# EAGLE design pxdr-001 (EAGLE 9.6.2)
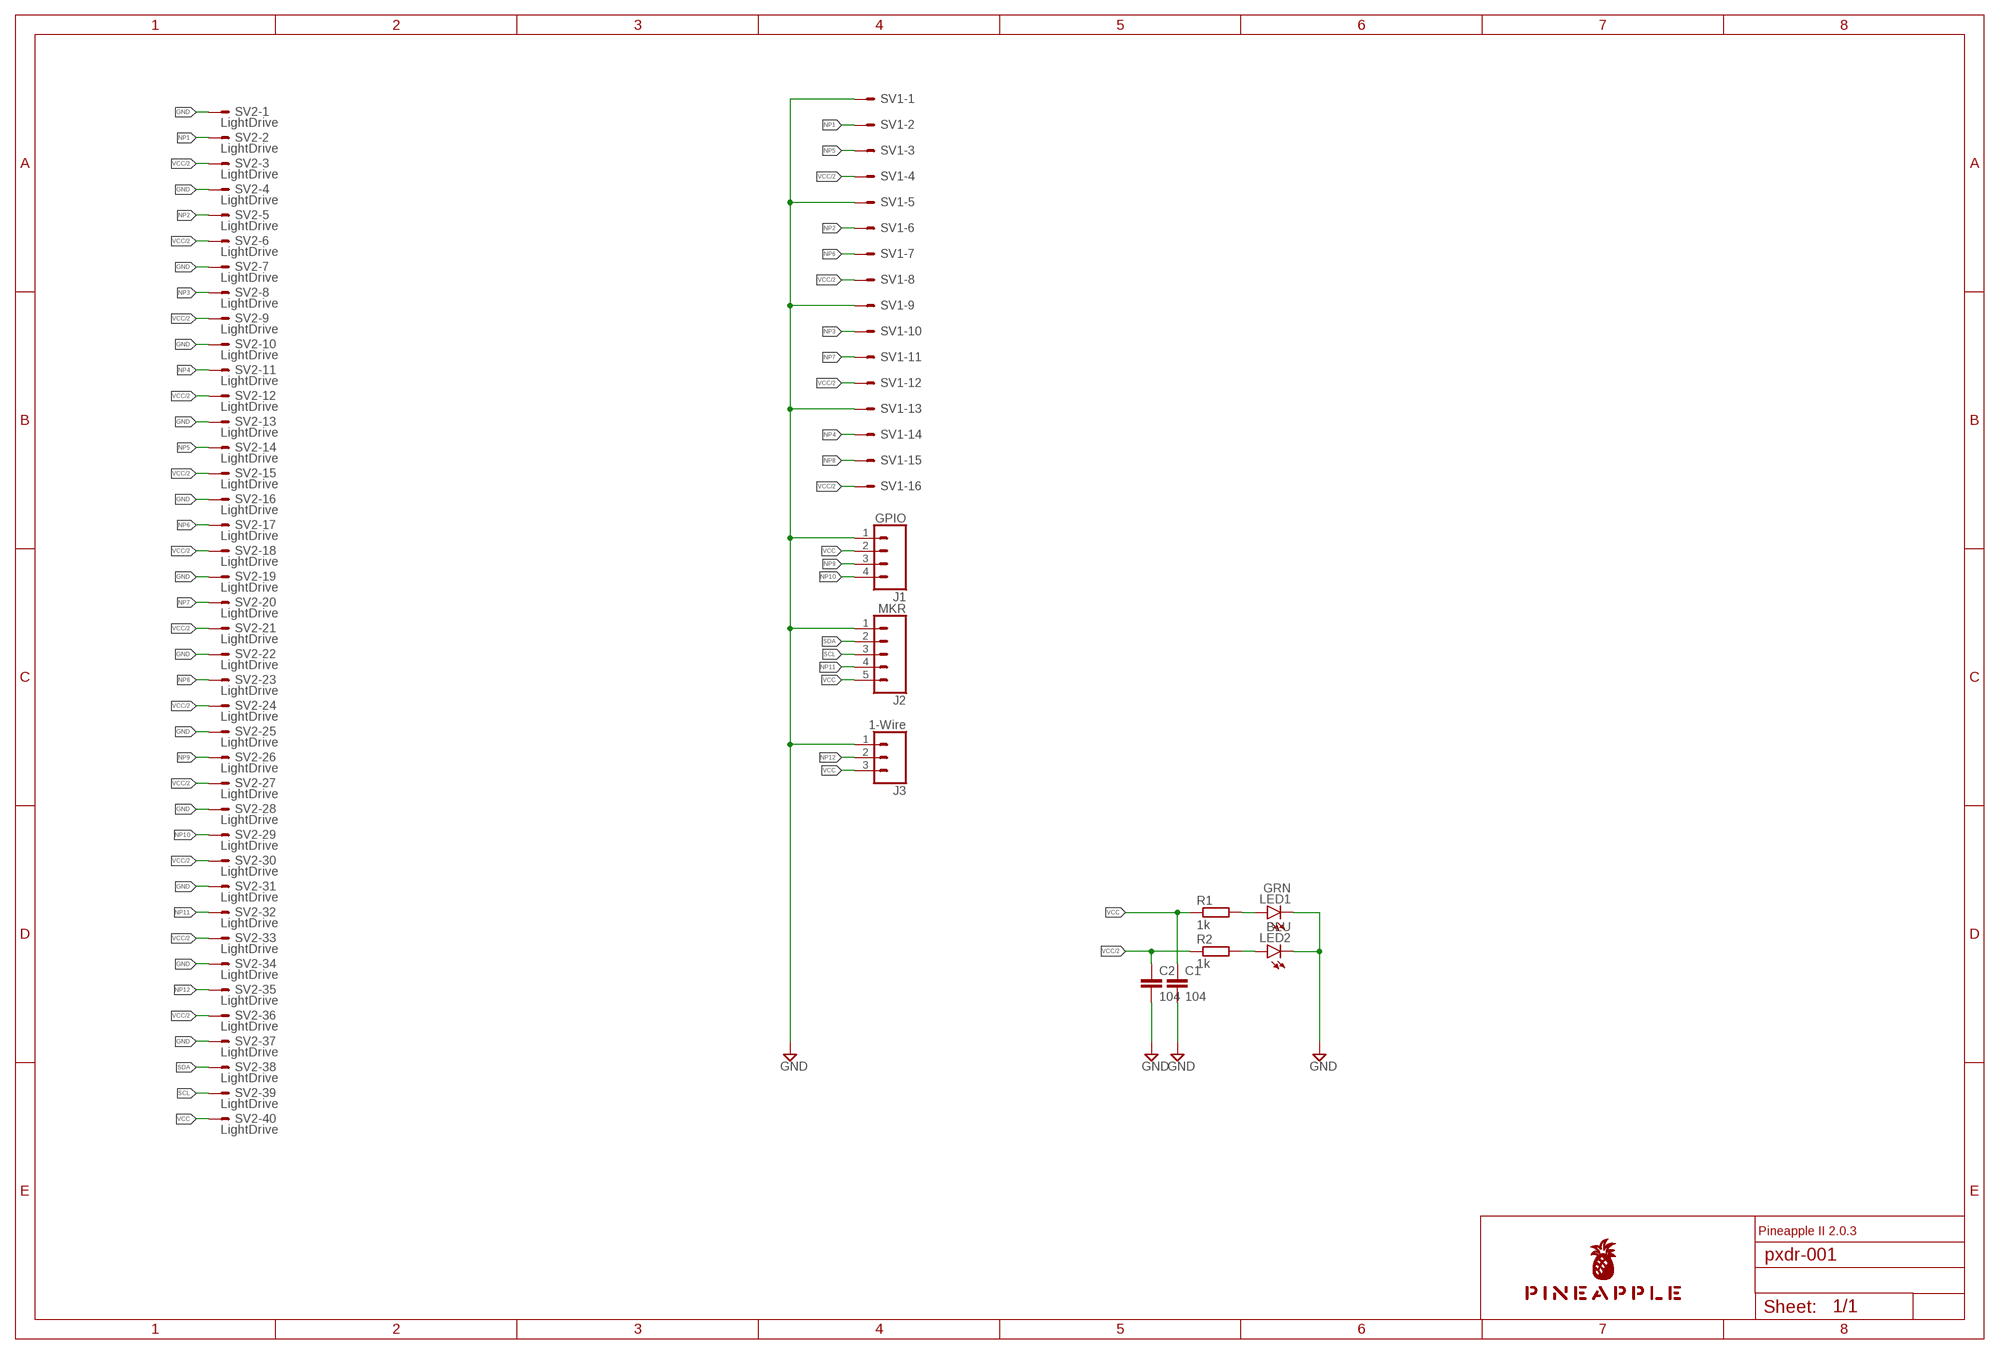
[diagram p0: schematic, sheet 1]

## Parts
C1  104  C-EU025-025X050  [C025-025X050]
C2  104  C-EU025-025X050  [C025-025X050]
J1  GPIO  CONN_04JST-PTH  [JST-4-PTH]
J2  MKR  CONN_05JST  [JST-5-PTH]
J3  1-Wire  CONN_03JST-PTH  [JST-3-PTH]
LED1  GRN  LEDB152  [Q62902-B152]
LED2  BLU  LEDB152  [Q62902-B152]
R1  1k  R-EU_0204/5  [0204/5]
R2  1k  R-EU_0204/5  [0204/5]
SV1  ML16LE  [ML16L]
SV2  LightDrive  ML40LE  [ML40L]
U$1  PINEAPPLE450_SILK  [PINEAPPLE450_SILK]

## Nets
GND [gnd]: C1.2 C2.2 J1.1 J2.1 J3.1 LED1.K(C) LED2.K(C) SV1.1 SV1.5 SV1.9 SV1.13 SV2.1 SV2.4 SV2.7 SV2.10 SV2.13 SV2.16 SV2.19 SV2.22 SV2.25 SV2.28 SV2.31 SV2.34 SV2.37
NP1: SV1.2 SV2.2
NP2: SV1.6 SV2.5
NP3: SV1.10 SV2.8
NP4: SV1.14 SV2.11
NP5: SV1.3 SV2.14
NP6: SV1.7 SV2.17
NP7: SV1.11 SV2.20
NP8: SV1.15 SV2.23
NP9: J1.3 SV2.26
NP10: J1.4 SV2.29
NP11: J2.4 SV2.32
NP12: J3.2 SV2.35
SCL: J2.3 SV2.39
SDA: J2.2 SV2.38
VCC [power]: C1.1 J1.2 J2.5 J3.3 R1.1 SV2.40
VCC2LED: LED2.A R2.2
VCC/2 [power]: C2.1 R2.1 SV1.4 SV1.8 SV1.12 SV1.16 SV2.3 SV2.6 SV2.9 SV2.12 SV2.15 SV2.18 SV2.21 SV2.24 SV2.27 SV2.30 SV2.33 SV2.36
VCCLED: LED1.A R1.2

## Notes on the sheet
- Pineapple II 2.0.3

## Library data of the parts
C1 C2 = rcl:C-EU: CAPACITOR, European symbol; SPICEPREFIX: C
J1 = SparkFun-Connectors:CONN_04: Multi connection point. Often used as Generic Header-pin footprint for 0.1 inch spaced/style header connections On any of the 0.1 inch spaced packages, you can populate with these: Break Away Headers - Straight <https://www.sparkfun.com/products/116> (PRT-00116) Break Away Male Headers - Right Angle <https://www.sparkfun.com/products/553> (PRT-00553) Female Headers <https://www.sparkfun.com/products/115> (PRT-00115) Break Away Headers - Machine Pin <https://www.sparkfun.com/products/117> (PRT-00117) Break Away Female Headers - Swiss Machine Pin <https://www.sparkfun.com/products/743> (PRT-00743) For SCREWTERMINALS and SPRING TERMINALS visit here: Screw Terimnals on SparkFun.com <https://www.sparkfun.com/search/results?term=Screw+Terminals> (5mm/3.5mm/2.54mm spacing) This device is also useful as a general connection point to wire up your design to another part of your project. Our various solder wires solder well into these plated through hole pads. Hook-Up Wire - Assortment (Stranded, 22 AWG) <https://www.sparkfun.com/products/11375> (PRT-11375) Hook-Up Wire - Assortment (Solid Core, 22 AWG) <https://www.sparkfun.com/products/11367> (PRT-11367) View the entire wire category on our website here <https://www.sparkfun.com/categories/141> Special notes: Molex polarized connector foot print use with SKU : PRT-08231 with associated crimp pins and housings. 1MM SMD Version SKU: PRT-10208; PROD_ID: WIRE-13531; SF_ID: PRT-09916
J2 = SparkFun-Connectors:CONN_05: Multi connection point. Often used as Generic Header-pin footprint for 0.1 inch spaced/style header connections On any of the 0.1 inch spaced packages, you can populate with these: Break Away Headers - Straight <https://www.sparkfun.com/products/116> (PRT-00116) Break Away Male Headers - Right Angle <https://www.sparkfun.com/products/553> (PRT-00553) Female Headers <https://www.sparkfun.com/products/115> (PRT-00115) Break Away Headers - Machine Pin <https://www.sparkfun.com/products/117> (PRT-00117) Break Away Female Headers - Swiss Machine Pin <https://www.sparkfun.com/products/743> (PRT-00743) For SCREWTERMINALS and SPRING TERMINALS visit here: Screw Terimnals on SparkFun.com <https://www.sparkfun.com/search/results?term=Screw+Terminals> (5mm/3.5mm/2.54mm spacing) This device is also useful as a general connection point to wire up your design to another part of your project. Our various solder wires solder well into these plated through hole pads. Hook-Up Wire - Assortment (Stranded, 22 AWG) <https://www.sparkfun.com/products/11375> (PRT-11375) Hook-Up Wire - Assortment (Solid Core, 22 AWG) <https://www.sparkfun.com/products/11367> (PRT-11367) View the entire wire category on our website here <https://www.sparkfun.com/categories/141> Special notes: Molex polarized connector foot print use with SKU : PRT-08231 with associated crimp pins and housings. 1MM SMD Version SKU: PRT-10208; SF_ID: PRT-09917
J3 = SparkFun-Connectors:CONN_03: Multi connection point. Often used as Generic Header-pin footprint for 0.1 inch spaced/style header connections On any of the 0.1 inch spaced packages, you can populate with these: Break Away Headers - Straight <https://www.sparkfun.com/products/116> (PRT-00116) Break Away Male Headers - Right Angle <https://www.sparkfun.com/products/553> (PRT-00553) Female Headers <https://www.sparkfun.com/products/115> (PRT-00115) Break Away Headers - Machine Pin <https://www.sparkfun.com/products/117> (PRT-00117) Break Away Female Headers - Swiss Machine Pin <https://www.sparkfun.com/products/743> (PRT-00743) Stackable Header - 3 Pin (Female, 0.1") <https://www.sparkfun.com/products/13875> (PRT-13875) For SCREWTERMINALS and SPRING TERMINALS visit here: Screw Terimnals on SparkFun.com <https://www.sparkfun.com/search/results?term=Screw+Terminals> (5mm/3.5mm/2.54mm spacing) This device is also useful as a general connection point to wire up your design to another part of your project. Our various solder wires solder well into these plated through hole pads. Hook-Up Wire - Assortment (Stranded, 22 AWG) <https://www.sparkfun.com/products/11375> (PRT-11375) Hook-Up Wire - Assortment (Solid Core, 22 AWG) <https://www.sparkfun.com/products/11367> (PRT-11367) View the entire wire category on our website here <https://www.sparkfun.com/categories/141> Special notes: Molex polarized connector foot print use with SKU : PRT-08232 with associated crimp pins and housings.; PROD_ID: WIRE-10037; SF_ID: PRT-09915
LED1 LED2 = led:LED: LED OSRAM: - CHIPLED LG R971, LG N971, LY N971, LG Q971, LY Q971, LO R971, LY R971 LH N974, LH R974 LS Q976, LO Q976, LY Q976 LO Q996 - Hyper CHIPLED LW Q18S LB Q993, LB Q99A, LB R99A - SideLED LS A670, LO A670, LY A670, LG A670, LP A670 LB A673, LV A673, LT A673, LW A673 LH A674 LY A675 LS A676, LA A676, LO A676, LY A676, LW A676 LS A679, LY A679, LG A679 - Hyper Micro SIDELED® LS Y876, LA Y876, LO Y876, LY Y876 LT Y87S - SmartLED LW L88C, LW L88S LB L89C, LB L89S, LG L890 LS L89K, LO L89K, LY L89K LS L896, LA L896, LO L896, LY L896 - TOPLED LS T670, LO T670, LY T670, LG T670, LP T670 LSG T670, LSP T670, LSY T670, LOP T670, LYG T670 LG T671, LOG T671, LSG T671 LB T673, LV T673, LT T673, LW T673 LH T674 LS T676, LA T676, LO T676, LY T676, LB T676, LH T676, LSB T676, LW T676 LB T67C, LV T67C, LT T67C, LS T67K, LO T67K, LY T67K, LW E67C LS E67B, LA E67B, LO E67B, LY E67B, LB E67C, LV E67C, LT E67C LW T67C LS T679, LY T679, LG T679 LS T770, LO T770, LY T770, LG T770, LP T770 LB T773, LV T773, LT T773, LW T773 LH T774 LS E675, LA E675, LY E675, LS T675 LS T776, LA T776, LO T776, LY T776, LB T776 LHGB T686 LT T68C, LB T68C - Hyper Mini TOPLED® LB M676 - Mini TOPLED Santana® LG M470 LS M47K, LO M47K, LY M47K Source: http://www.osram.convergy.de LUXEON: - LUMILED® LXK2-PW12-R00, LXK2-PW12-S00, LXK2-PW14-U00, LXK2-PW14-V00 LXK2-PM12-R00, LXK2-PM12-S00, LXK2-PM14-U00 LXK2-PE12-Q00, LXK2-PE12-R00, LXK2-PE12-S00, LXK2-PE14-T00, LXK2-PE14-U00 LXK2-PB12-K00, LXK2-PB12-L00, LXK2-PB12-M00, LXK2-PB14-N00, LXK2-PB14-P00, LXK2-PB14-Q00 LXK2-PR12-L00, LXK2-PR12-M00, LXK2-PR14-Q00, LXK2-PR14-R00 LXK2-PD12-Q00, LXK2-PD12-R00, LXK2-PD12-S00 LXK2-PH12-R00, LXK2-PH12-S00 LXK2-PL12-P00, LXK2-PL12-Q00, LXK2-PL12-R00 Source: www.luxeon.com KINGBRIGHT: KA-3528ASYC Source: www.kingbright.com
R1 R2 = rcl:R-EU_: RESISTOR, European symbol; SPICEPREFIX: R
SV1 = con-ml:ML16LE: HARTING; OC_FARNELL: unknown; OC_NEWARK: unknown
SV2 = con-ml:ML40LE: HARTING; OC_FARNELL: unknown; OC_NEWARK: unknown
U$1 = pineapple:PINEAPPLE450_SILK

## Net classes
0 default: width 0.152 mm, drill 0.152 mm, clearance 0.152 mm
1 gnd: width 0.305 mm, drill 0.152 mm, clearance 0.152 mm
2 power: width 0.508 mm, drill 0.152 mm, clearance 0.152 mm
3 analog: width 0.305 mm, drill 0.152 mm, clearance 0.152 mm
4 superpower: width 1.016 mm, drill 0.152 mm, clearance 0.152 mm

## Board
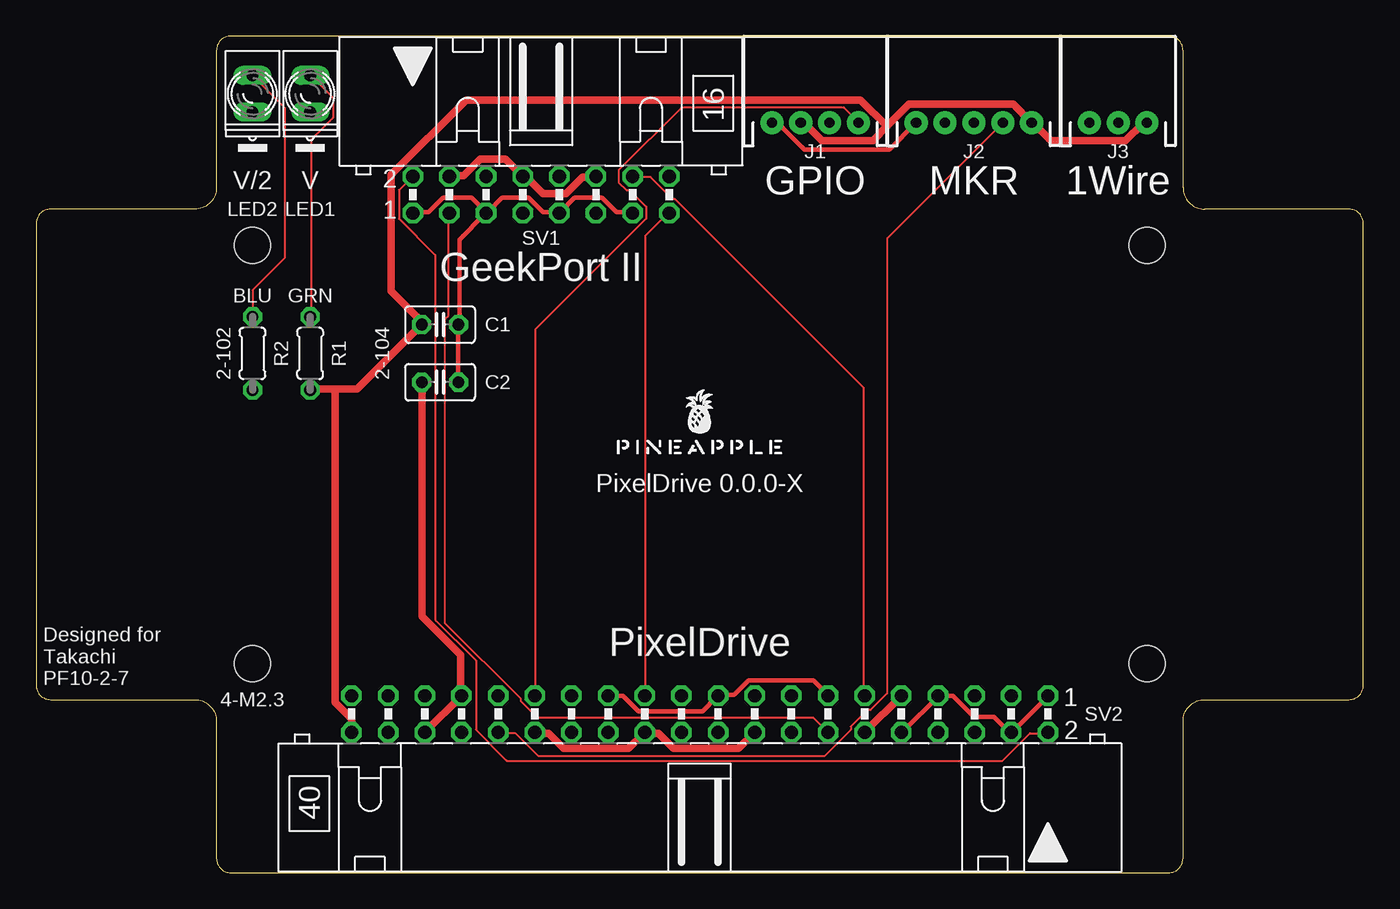
[diagram p1: board, top side]
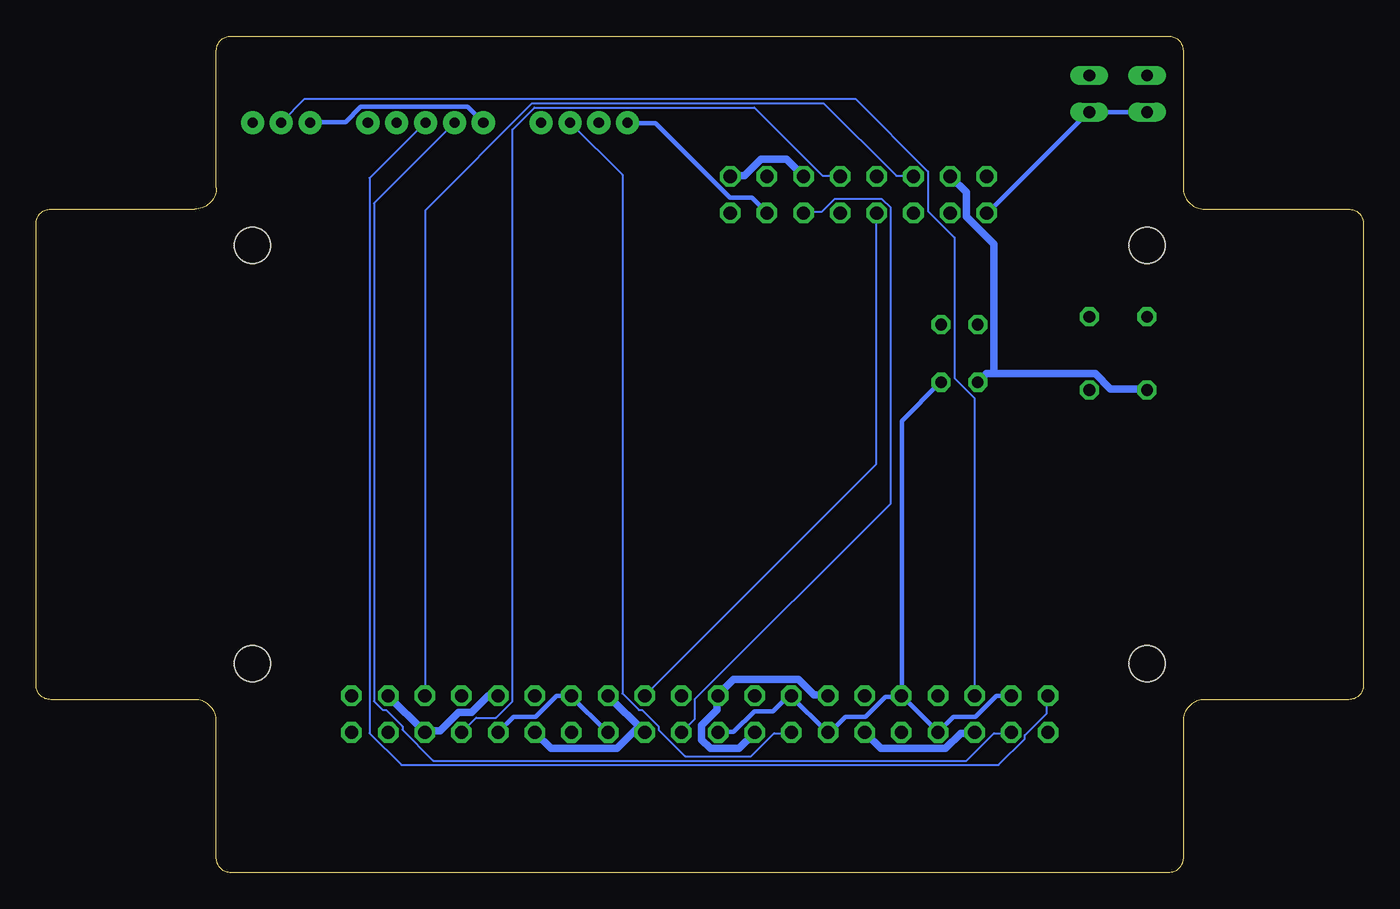
[diagram p2: board, bottom side, seen from below]

Size 92 x 58 mm. Coordinates in mm from the lower left corner, seen from the top.
Outline: 78.5,58 13.5,58 arc90 12.5,57 12.5,47.5 arc-90 11,46 1,46 arc90 0,45 0,13 arc90 1,12 11,12 arc-90 12.5,10.5 12.5,1 arc90 13.5,0 78.5,0 arc90 79.5,1 79.5,10.5 arc-90 81,12 91,12 arc90 92,13 92,45 arc90 91,46 81,46 arc-90 79.5,47.5 79.5,57 arc90 78.5,58
Copper layers (1*16): Top 0.035mm / dielectric 1.5mm / Bottom 0.035mm
Design rules "SeeedStudio_2layer_DRU_no_angle_20140221": minimum track width 6mil, minimum drill 12mil, track to track 6mil, track to pad 6mil, pad to pad 6mil, via to via 6mil, smd to smd 0mil, copper to edge 10mil, drill to drill 10mil, minimum pad ring 10mil, minimum via ring 6mil, stop-mask expansion 2mil, vias tented up to drill 100mil, thermal gap 10mil
Holes 2.5 mm at 77,43.5 15,43.5 15,14.5 77,14.5
tRestrict: area 13,41.5 to 17,45.5; area 75,41.5 to 79,45.5; area 13,12.5 to 17,16.5; area 75,12.5 to 79,16.5; area 0,57 to 92,58; area 91,0 to 92,58; area 0,0 to 92,1; area 0,0 to 1,58; area 0,45 to 12.5,46; area 12.5,46 to 13.5,58; area 78.5,46 to 79.5,58; area 79.5,45 to 92,46; 4 more areas
bRestrict: area 13,12.5 to 17,16.5; area 75,12.5 to 79,16.5; area 75,41.5 to 79,45.5; area 13,41.5 to 17,45.5; area 78.5,0 to 79.5,12; area 79.5,12 to 92,13; area 91,0 to 92,58; area 79.5,45 to 92,46; area 78.5,46 to 79.5,58; area 0,57 to 92,58; area 12.5,46 to 13.5,58; area 0,45 to 12.5,46; 4 more areas

### Footprints (pad centres in the part's own frame; a part is rotated, then mirrored left to right if it is on the bottom)
C025-025X050 = drill 0.813 octagon: 1 -1.27,0; 2 1.27,0
JST-4-PTH = drill 0.7 pad 1.6: 1 -3,0; 2 -1,0; 3 1,0; 4 3,0
JST-5-PTH = drill 0.7 pad 1.6: 1 -4,0; 2 -2,0; 3 0,0; 4 2,0; 5 4,0
JST-3-PTH = drill 0.7 pad 1.6: 1 -2,0; 2 0,0; 3 2,0
Q62902-B152 = drill 0.813 long: A 1.27,0; K -1.27,0
0204/5 = drill 0.813 octagon: 1 -2.54,0; 2 2.54,0
ML16L = drill 0.914 octagon: 1 -8.89,-1.27; 2 -8.89,1.27; 3 -6.35,-1.27; 4 -6.35,1.27; 5 -3.81,-1.27; 6 -3.81,1.27; 7 -1.27,-1.27; 8 -1.27,1.27; 9 1.27,-1.27; 10 1.27,1.27; 11 3.81,-1.27; 12 3.81,1.27; 13 6.35,-1.27; 14 6.35,1.27; 15 8.89,-1.27; 16 8.89,1.27
ML40L = drill 0.914 octagon: 1 -24.13,-1.27; 2 -24.13,1.27; 3 -21.59,-1.27; 4 -21.59,1.27; 5 -19.05,-1.27; 6 -19.05,1.27; 7 -16.51,-1.27; 8 -16.51,1.27; 9 -13.97,-1.27; 10 -13.97,1.27; 11 -11.43,-1.27; 12 -11.43,1.27; 13 -8.89,-1.27; 14 -8.89,1.27; 15 -6.35,-1.27; 16 -6.35,1.27; 17 -3.81,-1.27; 18 -3.81,1.27; 19 -1.27,-1.27; 20 -1.27,1.27; 21 1.27,-1.27; 22 1.27,1.27; 23 3.81,-1.27; 24 3.81,1.27; 25 6.35,-1.27; 26 6.35,1.27; 27 8.89,-1.27; 28 8.89,1.27; 29 11.43,-1.27; 30 11.43,1.27; 31 13.97,-1.27; 32 13.97,1.27; 33 16.51,-1.27; 34 16.51,1.27; 35 19.05,-1.27; 36 19.05,1.27; 37 21.59,-1.27; 38 21.59,1.27; 39 24.13,-1.27; 40 24.13,1.27

### Placement (x,y rotation side)
C1  28,38 0 top
C2  28,34 0 top
J1  54,52 0 top
J2  65,52 0 top
J3  75,52 0 top
LED1  19,54 90 top
LED2  15,54 90 top
R1  19,36 90 top
R2  15,36 90 top
SV1  35,47 0 top
SV2  46,11 180 top
U$1  46,29 0 top

### Tracks (layer width: path | path; a pad name or v marks a point on that pad's centre or on a via)
GND
  Top 0.305: SV2.13 54.86,12.34 53.87,13.34 49.38,13.34 48.39,12.34 47.32,12.34 SV2.19 47.17,12.19 46.18,11.2 41.76,11.2 40.69,12.27 39.7,12.27 SV2.25 | SV2.10 60.05,9.75 62.56,12.27 SV2.7 62.71,12.27 63.55,12.27 65,10.82 66.37,10.82 67.44,9.75 SV2.4 67.67,9.75 70.18,12.27 SV2.1 | J1.1 51.05,51.97 51.44,51.97 53.26,50.14 59.13,50.14 60.96,51.97 J2.1 | C2.2 29.26,34.06 29.26,37.95 C1.2 29.34,38.1 29.34,43.89 31.09,45.64 SV1.5 | SV1.1 26.14,45.8 27.2,45.8 28.19,46.79 30.18,46.79 31.17,45.8 SV1.5 | SV1.5 31.32,45.8 32.31,46.79 34.14,46.79 35.13,45.8 36.2,45.8 SV1.9 36.35,45.8 37.34,46.79 39.24,46.79 40.23,45.8 41.3,45.8 SV1.13
  Bottom 0.305: SV2.37 24.46,12.27 25.45,12.27 26.9,10.82 28.42,10.82 29.49,9.75 SV2.34 29.57,9.83 32,12.27 SV2.31 | SV2.22 44.73,9.75 43.66,9.75 42.22,11.2 40.92,11.2 39.85,12.27 SV2.25 39.7,12.27 37.19,9.75 SV2.28 36.96,9.75 35.89,10.82 34.52,10.82 33.15,12.19 32.16,12.19 SV2.31 | SV2.16 52.43,9.75 54.94,12.27 SV2.13 55.09,12.27 55.93,12.27 57.38,10.82 58.9,10.82 59.97,9.75 SV2.10 | J3.1 73,52.05 70.56,52.05 69.49,53.11 62.1,53.11 61.04,52.05 J2.1 | LED2.K 18.97,52.73 LED1.K 19.13,52.65 26.06,45.72 SV1.1 | J1.1 50.98,51.97 49.07,51.97 43.89,46.79 42.37,46.79 41.38,45.8 SV1.13 | SV2.31 32,12.42 32,31.32 29.34,33.98 C2.2
NP1
  Top 0.152: SV2.2 70.1,9.68 68.89,9.68 66.98,7.77 32.61,7.77 30.48,9.91 30.48,14.71 27.66,17.53 27.66,42.82 25.15,45.34 25.15,47.32 26.06,48.23 SV1.2
NP2
  Bottom 0.152: SV1.6 31.24,48.31 32.38,48.31 37.41,53.34 57.61,53.34 65,45.95 65,12.34 SV2.5
NP3
  Bottom 0.152: SV1.10 36.27,48.31 37.49,48.31 42.22,53.03 57.45,53.03 58.98,51.51 58.98,11.89 60.12,10.74 61.49,10.74 62.48,9.75 SV2.8
NP4
  Top 0.152: SV1.14 41.38,48.23 42.6,48.23 44.12,46.71 44.27,46.71 57.38,33.6 57.38,12.34 SV2.11
NP5
  Top 0.152: SV1.3 28.57,45.72 28.57,38.63 28.35,38.41 28.35,17.3 33.6,12.04 33.6,11.89 34.75,10.74 53.87,10.74 54.86,9.75 SV2.14
NP6
  Bottom 0.152: SV1.7 33.76,45.72 33.76,28.35 49.76,12.34 SV2.17
NP7
  Bottom 0.152: SV1.11 38.79,45.8 37.57,45.8 36.65,46.71 33.38,46.71 32.77,46.1 32.77,25.6 46.33,12.04 46.33,10.67 47.24,9.75 SV2.20
NP8
  Top 0.152: SV2.23 42.22,12.34 42.22,44.12 43.81,45.72 SV1.15
NP9
  Bottom 0.152: SV2.26 39.7,9.68 40.84,9.68 42.44,8.08 47.02,8.08 48.84,9.91 48.84,10.13 49.99,11.28 50.22,11.28 51.36,12.42 51.36,48.39 54.94,51.97 J1.3
NP10
  Top 0.152: SV2.29 34.59,12.34 34.59,37.64 42.29,45.34 42.29,46.18 41.15,47.32 40.92,47.32 40.39,47.85 40.39,48.69 44.73,53.03 56.01,53.03 57,52.05 J1.4
NP11
  Top 0.152: SV2.32 32.08,9.68 33.22,9.68 34.82,8.08 54.63,8.08 56.46,9.91 56.46,10.13 57.61,11.28 57.84,11.28 58.98,12.42 58.98,43.97 66.98,51.97 J2.4
NP12
  Bottom 0.152: SV2.35 26.98,12.34 26.98,32.92 28.35,34.29 28.35,44.04 30.18,45.87 30.18,48.62 35.2,53.65 73.38,53.65 74.98,52.05 J3.2
SCL
  Bottom 0.152: SV2.39 21.95,12.27 21.95,11.05 23.47,9.53 23.47,9.3 25.3,7.47 66.67,7.47 68.89,9.68 68.89,48.16 65.08,51.97 J2.3
SDA
  Bottom 0.152: SV2.38 24.46,9.68 25.6,9.68 27.51,7.77 64.47,7.77 66.6,9.91 66.6,10.13 67.74,11.28 67.97,11.28 68.58,11.89 68.58,46.41 63.02,51.97 J2.2
VCC
  Top 0.508: 58.98,51.74 60.5,53.26 67.74,53.26 68.96,52.05 J2.5 69.19,51.89 70.33,50.75 75.51,50.75 76.73,51.97 76.96,51.97 J3.3 | 58.98,51.74 57.99,50.75 54.48,50.75 53.26,51.97 53.03,51.97 J1.2 | 20.73,33.53 22.25,33.53 26.67,37.95 C1.1 26.67,38.25 24.61,40.31 24.61,48.39 29.79,53.57 57.15,53.57 58.98,51.74 | 20.73,33.53 19.05,33.53 R1.1 | 20.73,33.53 20.73,11.81 21.87,10.67 21.87,9.75 SV2.40
VCC2LED
  Top 0.152: R2.2 15.01,38.56 15.01,40.39 17.22,42.6 17.22,53.03 15.01,55.24 LED2.A
VCC/2
  Top 0.508: SV2.36 26.98,9.75 SV2.33 29.41,12.5 29.41,15.09 26.75,17.75 26.75,33.98 C2.1 | SV2.30 34.59,9.68 35.51,9.68 36.58,8.61 41.07,8.61 42.14,9.68 SV2.24 42.44,9.68 43.13,9.68 44.2,8.61 48.69,8.61 49.76,9.68 SV2.18 | SV2.12 57.45,9.75 SV2.9 | SV1.4 28.65,48.31 29.64,48.31 30.79,49.45 32.54,49.45 33.68,48.31 SV1.8 33.98,48.23 35.13,47.09 36.73,47.09 37.87,48.23 38.79,48.23 SV1.12
  Bottom 0.508: SV2.27 37.19,12.34 38.1,12.34 39.17,13.41 43.66,13.41 44.73,12.34 SV2.21 44.81,12.04 44.81,11.28 45.87,10.21 45.87,9.22 45.26,8.61 43.28,8.61 42.22,9.68 SV2.24 | SV2.36 26.98,9.68 27.89,9.68 28.96,8.61 33.45,8.61 34.52,9.68 SV2.30 | SV2.3 65.08,9.75 SV2.6 64.85,9.83 64.01,9.83 62.71,11.12 61.8,11.12 60.66,12.27 60.05,12.27 SV2.9 | SV2.15 49.84,9.75 SV2.18 50.37,9.98 51.74,8.61 56.31,8.61 57.38,9.68 SV2.12 | 25.6,34.59 26.14,34.59 26.67,34.06 C2.1 | 25.6,34.59 18.59,34.59 17.53,33.53 15.01,33.53 R2.1 | SV1.16 43.81,48.31 42.9,48.31 41.76,49.45 40.01,49.45 38.86,48.31 SV1.12 | 25.6,34.59 25.6,43.59 27.51,45.49 27.51,47.17 28.57,48.23 SV1.4
VCCLED
  Top 0.152: R1.2 19.05,38.56 19.05,50.83 20.57,52.35 20.57,53.72 19.05,55.24 LED1.A

### Text on the board
tNames: V/2 | V | GPIO | MKR | 1Wire | GeekPort II | BLU | GRN | 2-102 | 2-104 | PixelDrive 0.0.0-X | PixelDrive | Designed for / Takachi / PF10-2-7 | 4-M2.3